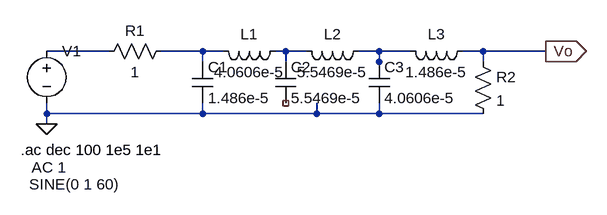
[diagram p0: schematic Circuito_normalizado.asc]
Circuito_normalizado.asc, the LTspice schematic file:
Version 4
SHEET 1 1832 680
WIRE 192 64 96 64
WIRE 336 64 272 64
WIRE 368 64 336 64
WIRE 464 64 448 64
WIRE 496 64 464 64
WIRE 608 64 576 64
WIRE 656 64 608 64
WIRE 768 64 736 64
WIRE 864 64 768 64
WIRE 336 80 336 64
WIRE 464 80 464 64
WIRE 608 80 608 64
WIRE 768 80 768 64
WIRE 608 96 608 80
WIRE 96 160 96 144
WIRE 336 160 336 144
WIRE 336 160 96 160
WIRE 512 160 512 144
WIRE 512 160 336 160
WIRE 608 160 608 144
WIRE 608 160 512 160
WIRE 768 160 608 160
WIRE 96 176 96 160
FLAG 864 64 Vo
IOPIN 864 64 Out
FLAG 96 176 0
SYMBOL voltage 96 48 R0
WINDOW 123 -23 195 Left 2
WINDOW 39 0 0 Left 0
WINDOW 3 -27 221 Left 2
SYMATTR Value2 AC 1
SYMATTR InstName V1
SYMATTR Value SINE(0 1 60)
SYMBOL res 288 48 R90
WINDOW 0 0 56 VBottom 2
WINDOW 3 32 56 VTop 2
SYMATTR InstName R1
SYMATTR Value 1
SYMBOL cap 320 80 R0
SYMATTR InstName C1
SYMATTR Value 1.486e-5
SYMBOL cap 448 80 R0
SYMATTR InstName C2
SYMATTR Value 5.5469e-5
SYMBOL cap 592 80 R0
SYMATTR InstName C3
SYMATTR Value 4.0606e-5
SYMBOL ind 464 48 R90
WINDOW 0 5 56 VBottom 2
WINDOW 3 32 56 VTop 2
SYMATTR InstName L1
SYMATTR Value 4.0606e-5
SYMBOL ind 592 48 R90
WINDOW 0 5 56 VBottom 2
WINDOW 3 32 56 VTop 2
SYMATTR InstName L2
SYMATTR Value 5.5469e-5
SYMBOL ind 752 48 R90
WINDOW 0 5 56 VBottom 2
WINDOW 3 32 56 VTop 2
SYMATTR InstName L3
SYMATTR Value 1.486e-5
SYMBOL res 752 64 R0
SYMATTR InstName R2
SYMATTR Value 1
TEXT 56 216 Left 2 !.ac dec 100 1e5 1e1

The netlist it stands for:
* Circuito_normalizado.asc
V1 N001 0 SINE(0 1 60) AC 1
R1 N002 N001 1
C1 N002 0 1.486e-5
C2 N003 NC_01 5.5469e-5
C3 N004 0 4.0606e-5
L1 N003 N002 4.0606e-5
L2 N004 N003 5.5469e-5
L3 Vo N004 1.486e-5
R2 Vo 0 1
.ac dec 100 1e5 1e1
.backanno
.end